# Altium schematic sheet NROM-FlashCart-1.SchDoc: NROM Flash Cart 1
size Tabloid; DrawnBy: M. Spinks; SheetNumber: 1; SheetTotal: 1; PageSetup: Record=PageOptions|CenterHorizontal=True|CenterVertical=True|PrintScale=0.98|XCorrection=1.00|YCorrection=1.00|PrintKind=1|BorderSize=5000000|LeftOffset=0|BottomOffset=0|Orientation=2|PaperLength=1000|PaperWidth=1000|Scale=100|PaperSource=7|PrintQuality=-4|MediaType=1|DitherType=10|PaperKind=Tabloid|PrintScaleMode=1
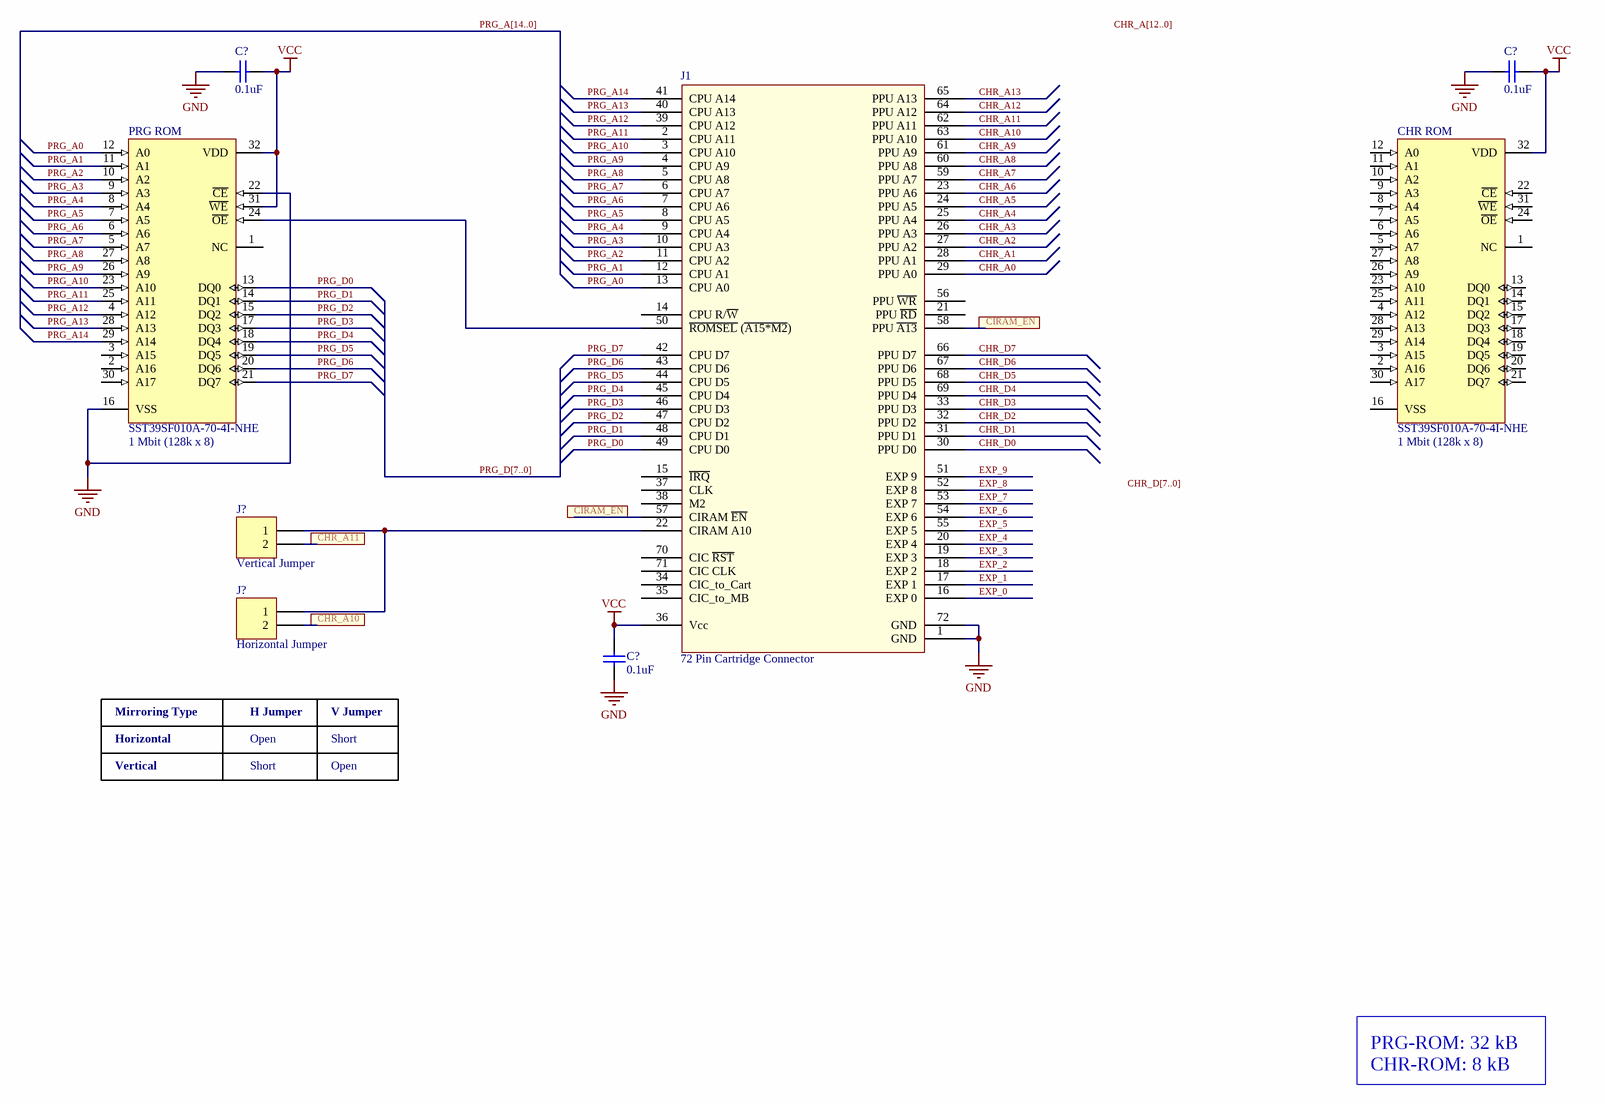
[diagram p0: NROM-FlashCart-1.SchDoc]

## Parts
(Parts that share a designator on the sheet are numbered #1, #2 ... from top to bottom, then left to right.)
C?#1  value 0.1uF  [CAP 0805_N]  (hidden comment: Cap Ceramic)
C?#2  value 0.1uF  [CAP 0805_N]  (hidden comment: Cap Ceramic)
C?#3  value 0.1uF  [CAP 0805_N]  (hidden comment: Cap Ceramic)
CHR_ROM  Size: 1 Mbit (128k x 8)  [PLCC-32N-SOCKET (8432-11B1-xx-xx)]  (hidden comment: SST39SF010A-70-4I-NHE)
J1  72 Pin Cartridge Connector  [72-PIN-CART-1]
J?#1  Label: Vertical Jumper  [HDR1X2 VERT]  (hidden comment: Header 1x2 Vert)
J?#2  Label: Horizontal Jumper  [HDR1X2 VERT]  (hidden comment: Header 1x2 Vert)
PRG_ROM  Size: 1 Mbit (128k x 8)  [PLCC-32N-SOCKET (8432-11B1-xx-xx)]  (hidden comment: SST39SF010A-70-4I-NHE)

## Nets
GND: C?#1.2 C?#2.1 C?#3.1 J1.1(GND) J1.72(GND) PRG_ROM.16(VSS) PRG_ROM.22(~{CE})
VCC: C?#1.1 C?#2.2 C?#3.2 CHR_ROM.32(VDD) J1.36(Vcc) PRG_ROM.31(~{WE}) PRG_ROM.32(VDD)
CHR_A0: J1.29(PPU_A0)
CHR_A1: J1.28(PPU_A1)
CHR_A2: J1.27(PPU_A2)
CHR_A3: J1.26(PPU_A3)
CHR_A4: J1.25(PPU_A4)
CHR_A5: J1.24(PPU_A5)
CHR_A6: J1.23(PPU_A6)
CHR_A7: J1.59(PPU_A7)
CHR_A8: J1.60(PPU_A8)
CHR_A9: J1.61(PPU_A9)
CHR_A10: J1.63(PPU_A10) J?#2.2
CHR_A11: J1.62(PPU_A11) J?#1.2
CHR_A12: J1.64(PPU_A12)
CHR_A13: J1.65(PPU_A13)
CHR_D0: J1.30(PPU_D0)
CHR_D1: J1.31(PPU_D1)
CHR_D2: J1.32(PPU_D2)
CHR_D3: J1.33(PPU_D3)
CHR_D4: J1.69(PPU_D4)
CHR_D5: J1.68(PPU_D5)
CHR_D6: J1.67(PPU_D6)
CHR_D7: J1.66(PPU_D7)
CIRAM_EN: J1.57(CIRAM_~{EN}) J1.58(PPU_~{A13})
EXP_0: J1.16(EXP_0)
EXP_1: J1.17(EXP_1)
EXP_2: J1.18(EXP_2)
EXP_3: J1.19(EXP_3)
EXP_4: J1.20(EXP_4)
EXP_5: J1.55(EXP_5)
EXP_6: J1.54(EXP_6)
EXP_7: J1.53(EXP_7)
EXP_8: J1.52(EXP_8)
EXP_9: J1.51(EXP_9)
PRG_A0: J1.13(CPU_A0) PRG_ROM.12(A0)
PRG_A1: J1.12(CPU_A1) PRG_ROM.11(A1)
PRG_A2: J1.11(CPU_A2) PRG_ROM.10(A2)
PRG_A3: J1.10(CPU_A3) PRG_ROM.9(A3)
PRG_A4: J1.9(CPU_A4) PRG_ROM.8(A4)
PRG_A5: J1.8(CPU_A5) PRG_ROM.7(A5)
PRG_A6: J1.7(CPU_A6) PRG_ROM.6(A6)
PRG_A7: J1.6(CPU_A7) PRG_ROM.5(A7)
PRG_A8: J1.5(CPU_A8) PRG_ROM.27(A8)
PRG_A9: J1.4(CPU_A9) PRG_ROM.26(A9)
PRG_A10: J1.3(CPU_A10) PRG_ROM.23(A10)
PRG_A11: J1.2(CPU_A11) PRG_ROM.25(A11)
PRG_A12: J1.39(CPU_A12) PRG_ROM.4(A12)
PRG_A13: J1.40(CPU_A13) PRG_ROM.28(A13)
PRG_A14: J1.41(CPU_A14) PRG_ROM.29(A14)
PRG_D0: J1.49(CPU_D0) PRG_ROM.13(DQ0)
PRG_D1: J1.48(CPU_D1) PRG_ROM.14(DQ1)
PRG_D2: J1.47(CPU_D2) PRG_ROM.15(DQ2)
PRG_D3: J1.46(CPU_D3) PRG_ROM.17(DQ3)
PRG_D4: J1.45(CPU_D4) PRG_ROM.18(DQ4)
PRG_D5: J1.44(CPU_D5) PRG_ROM.19(DQ5)
PRG_D6: J1.43(CPU_D6) PRG_ROM.20(DQ6)
PRG_D7: J1.42(CPU_D7) PRG_ROM.21(DQ7)
NetJ1_22: J1.22(CIRAM_A10) J?#1.1 J?#2.1
NetJ1_50: J1.50(~{ROMSEL}_(~{A15*M2})) PRG_ROM.24(~{OE})

Not connected (* = marked no-connect by the designer): CHR_ROM 1(NC) 2(A16) 3(A15) 4(A12) 5(A7) 6(A6) 7(A5) 8(A4) 9(A3) 10(A2) 11(A1) 12(A0) 13(DQ0) 14(DQ1) 15(DQ2) 16(VSS) 17(DQ3) 18(DQ4) 19(DQ5) 20(DQ6) 21(DQ7) 22(~{CE}) 23(A10) 24(~{OE}) 25(A11) 26(A9) 27(A8) 28(A13) 29(A14) 30(A17) 31(~{WE}); J1 14(CPU_R/~{W}) 15(~{IRQ}) 21(PPU_~{RD}) 34(CIC_to_Cart) 35(CIC_to_MB) 37(CLK) 38(M2) 56(PPU_~{WR}) 70(CIC_~{RST}) 71(CIC_CLK); PRG_ROM 1(NC) 2(A16) 3(A15) 30(A17)

## Buses and harness runs
bus CHR_A[12..0]
bus CHR_D[7..0]
bus PRG_A[14..0]
bus PRG_D[7..0]

## Notes on the sheet
- Mirroring Type
- H Jumper
- V Jumper
- Horizontal
- Vertical
- Open
- Short
- PRG-ROM: 32 kB
  CHR-ROM: 8 kB
- Labels drawn without touching a wire or pin: CHR_A[12..0], CHR_D[7..0]
- Title
- Size:
- Date:
- Ledger
- Drawn By:
- Time:
- Revision:
- Sheet
- of
- File:

## Library data of the parts
C?#1-C?#3 = 0805-X7R-4-10-50V: CAP, CER, 0805, 0.1uF, 50V, X7R, 10%; ReferencePart: VJ0805Y104KXXCW1BC; Voltage: 50V
CHR_ROM PRG_ROM = SST39SF010A-PLCC: 1Mbit (128k x 8) Flash Memory, PLCC-32, 5V; Value: SST39SF010A-70-4I-NHE
J1 = 72 Pin Cart
J?#1 J?#2 = Header 1x2 Vert: Header, 2 Pin, 2.54mm Pitch, Vertical